# EAGLE design DAC (EAGLE 8.4.3)
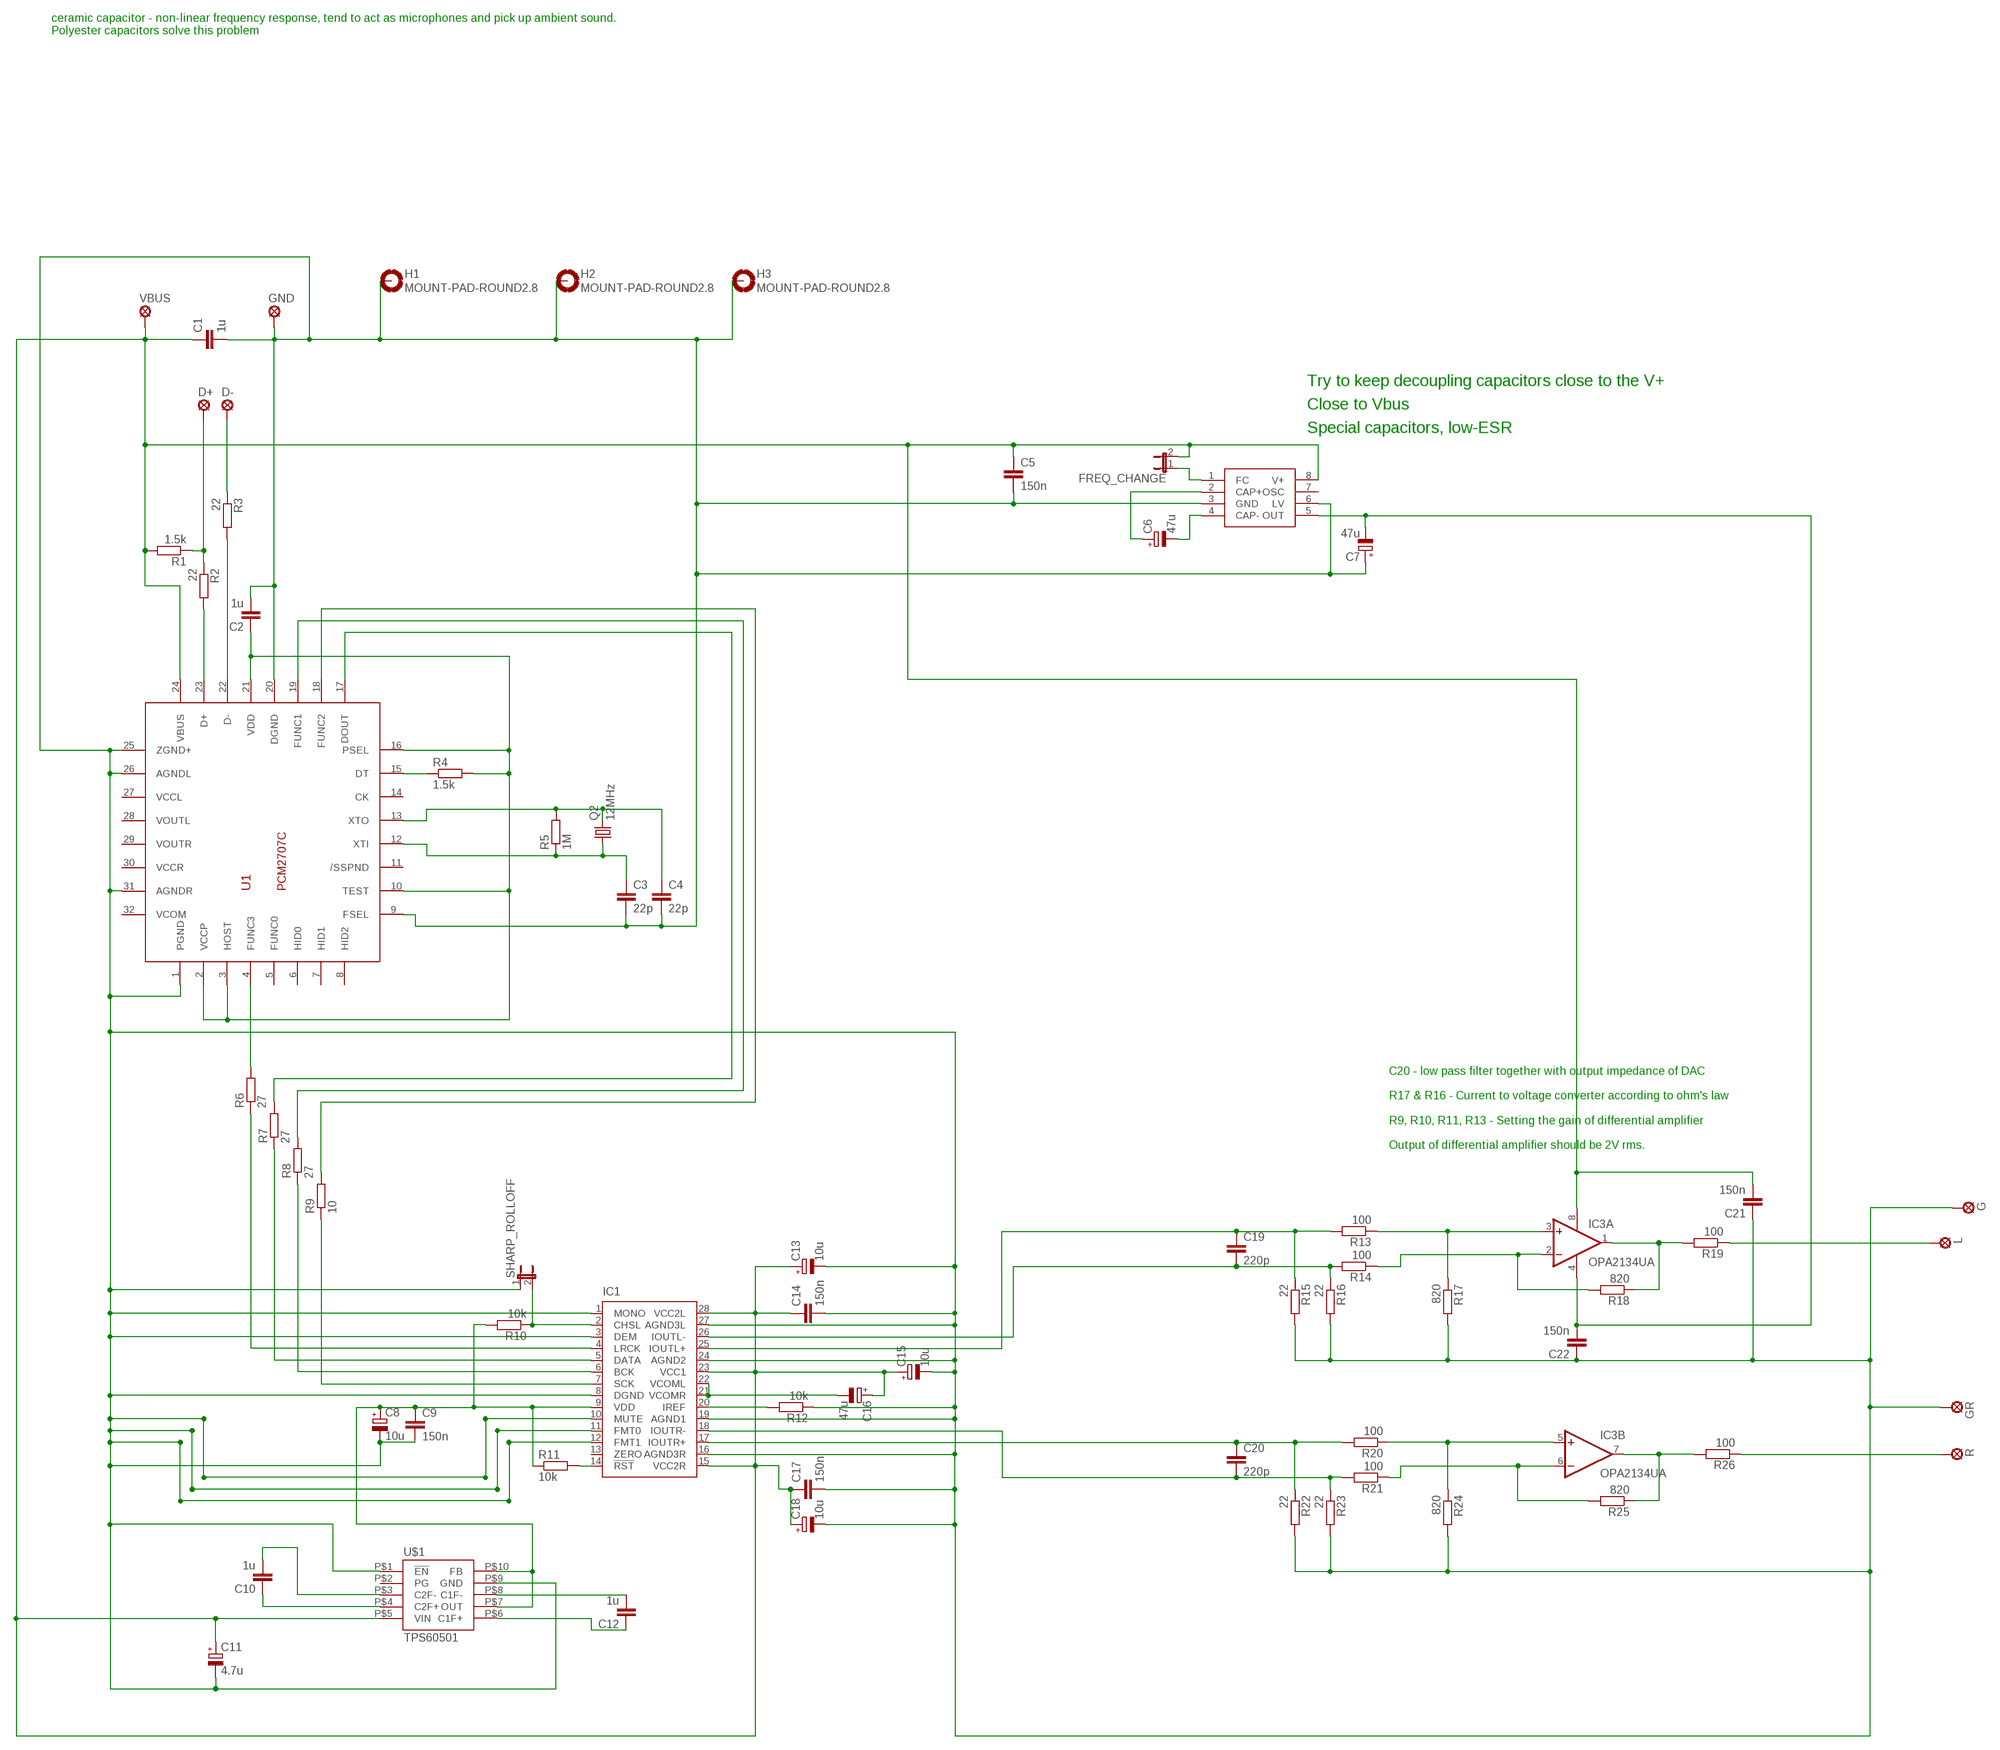
[diagram p0: schematic, sheet 1]

## Parts
C1  1u  C-EU050-050X075  [C050-050X075]
C2  1u  C-EU050-050X075  [C050-050X075]
C3  22p  C-EUC0603  [C0603]
C4  22p  C-EUC0603  [C0603]
C5  150n  C-EU050-025X075  [C050-025X075]
C6  47u  CPOL-EUD  [PANASONIC_D]
C7  47u  CPOL-EUD  [PANASONIC_D]
C8  10u  CPOL-EU153CLV-0405  [153CLV-0405]
C9  150n  C-EU050-025X075  [C050-025X075]
C10  1u  C-EU050-050X075  [C050-050X075]
C11  4.7u  CPOL-EUE2-5  [E2-5]
C12  1u  C-EU050-050X075  [C050-050X075]
C13  10u  CPOL-EUE2-5  [E2-5]
C14  150n  C-EU050-025X075  [C050-025X075]
C15  10u  CPOL-EUE2-5  [E2-5]
C16  47u  CPOL-EUE2-5  [E2-5]
C17  150n  C-EU050-025X075  [C050-025X075]
C18  10u  CPOL-EUE2-5  [E2-5]
C19  220p  C-EU025-024X044  [C025-024X044]
C20  220p  C-EU025-024X044  [C025-024X044]
C21  150n  C-EU050-025X075  [C050-025X075]
C22  150n  C-EU050-025X075  [C050-025X075]
D+  LSP10  [LSP10]
D-  LSP10  [LSP10]
FREQ_CHANGE  JP1E  [JP1]
G  LSP10  [LSP10]
GND  LSP10  [LSP10]
GR  LSP10  [LSP10]
H1  MOUNT-PAD-ROUND2.8  [2,8-PAD]
H2  MOUNT-PAD-ROUND2.8  [2,8-PAD]
H3  MOUNT-PAD-ROUND2.8  [2,8-PAD]
IC1  PCM1794A  [SSOP28DB]
IC3  OPA2134UA  [SO08]
L  LSP10  [LSP10]
Q2  12MHz  CRYSTALHC49S  [HC49/S]
R  LSP10  [LSP10]
R1  1.5k  R-EU_R0603  [R0603]
R2  22  R-EU_R0603  [R0603]
R3  22  R-EU_R0603  [R0603]
R4  1.5k  R-EU_R0603  [R0603]
R5  1M  R-EU_R0603  [R0603]
R6  27  R-EU_R0603  [R0603]
R7  27  R-EU_R0603  [R0603]
R8  27  R-EU_R0603  [R0603]
R9  10  R-EU_R0603  [R0603]
R10  10k  R-EU_R0603  [R0603]
R11  10k  R-EU_R0603  [R0603]
R12  10k  R-EU_0207/10  [0207/10]
R13  100  R-EU_0207/10  [0207/10]
R14  100  R-EU_0207/10  [0207/10]
R15  22  R-EU_0207/10  [0207/10]
R16  22  R-EU_0207/10  [0207/10]
R17  820  R-EU_0207/10  [0207/10]
R18  820  R-EU_0207/10  [0207/10]
R19  100  R-EU_0207/10  [0207/10]
R20  100  R-EU_0207/10  [0207/10]
R21  100  R-EU_0207/10  [0207/10]
R22  22  R-EU_0207/10  [0207/10]
R23  22  R-EU_0207/10  [0207/10]
R24  820  R-EU_0207/10  [0207/10]
R25  820  R-EU_0207/10  [0207/10]
R26  100  R-EU_0207/10  [0207/10]
SHARP_ROLLOFF  JP1E  [JP1]
U1  PCM2707C  PCM2707C_TQFP32"  [32TQFP_PCM2707C]
U$1  TPS60501  [VSSOP10]
U$2  LM2662  [SOIC8]
VBUS  LSP10  [LSP10]

## Nets
D+: D+.MP R1.1 R2.1
D-: D-.MP R3.1
GND: C1.2 C2.2 C3.2 C4.2 C5.2 C7.+ C8.- C9.2 C11.- C13.- C14.2 C15.- C17.2 C18.- C21.1 C22.1 G.MP GND.MP GR.MP H1.B2,8(MOUNT) H2.B2,8(MOUNT) H3.B2,8(MOUNT) IC1.1(MONO) IC1.3(DEM) IC1.8(DGND) IC1.10(MUTE) IC1.11(FMT0) IC1.12(FMT1) IC1.16(AGND3R) IC1.19(AGND1) IC1.24(AGND2) IC1.27(AGND3L) R12.1 R15.2 R16.2 R17.2 R22.2 R23.2 R24.2 SHARP_ROLLOFF.1 U1.1(PGND) U1.9(FSEL) U1.20(DGND) U1.25(ZGND+) U1.26(AGNDL) U1.31(AGNDR) U$1.P$1(!EN) U$1.P$9(GND) U$2.3(GND) U$2.6(LV)
N$1: R2.2 U1.23(D+)
N$2: R3.2 U1.22(D-)
N$3: C2.1 R4.2 U1.2(VCCP) U1.3(HOST) U1.10(TEST) U1.16(PSEL) U1.21(VDD)
N$4: R4.1 U1.15(DT)
N$5: C4.1 Q2.2 R5.2 U1.13(XTO)
N$6: C3.1 Q2.1 R5.1 U1.12(XTI)
N$7: C10.1 U$1.P$4(C2F+)
N$8: C10.2 U$1.P$3(C2F-)
N$9: IC1.20(IREF) R12.2
N$10: C12.2 U$1.P$8(C1F-)
N$11: C6.- U$2.4(CAP-)
N$12: IC1.5(DATA) R7.1
N$13: IC3.2(A:-IN) R14.1 R18.2
N$14: IC3.7(B:OUT) R25.1 R26.2
N$15: C12.1 U$1.P$6(C1F+)
N$17: IC1.14(!RST) R11.2
N$18: IC1.6(BCK) R8.1
N$19: IC1.2(CHSL) R10.1 SHARP_ROLLOFF.2
N$20: IC1.4(LRCK) R6.1
N$21: R7.2 U1.17(DOUT)
N$22: R8.2 U1.19(FUNC1)
N$23: R9.2 U1.18(FUNC2)
N$24: C19.2 IC1.26(IOUTL-) R14.2 R16.1
N$25: C19.1 IC1.25(IOUTL+) R13.2 R15.1
N$26: C20.1 IC1.17(IOUTR+) R20.2 R22.1
N$27: C20.2 IC1.18(IOUTR-) R21.2 R23.1
N$28: IC3.6(B:-IN) R21.1 R25.2
N$29: IC3.1(A:OUT) R18.1 R19.2
N$30: FREQ_CHANGE.1 U$2.1(FC)
N$31: C6.+ U$2.2(CAP+)
N$32: IC3.3(A:+IN) R13.1 R17.1
N$33: C16.- IC1.21(VCOMR) IC1.22(VCOML)
N$35: L.MP R19.1
N$36: IC3.5(B:+IN) R20.1 R24.1
N$37: C1.1 C5.1 C11.+ C13.+ C14.1 C15.+ C16.+ C17.1 C18.+ C21.2 FREQ_CHANGE.2 IC1.15(VCC2R) IC1.23(VCC1) IC1.28(VCC2L) IC3.8(A:V+) R1.2 U1.24(VBUS) U$1.P$5(VIN) U$2.8(V+) VBUS.MP
N$38: C8.+ C9.1 IC1.9(VDD) R10.2 R11.1 U$1.P$7(OUT) U$1.P$10(FB)
N$39: R26.1 R.MP
N$40: IC1.7(SCK) R9.1
N$43: R6.2 U1.4(FUNC3)
NEG_VOLTAGE: C7.- C22.2 IC3.4(A:V-) U$2.5(OUT)
Unconnected: IC1.13(ZERO) U1.5(FUNC0) U1.6(HID0) U1.7(HID1) U1.8(HID2) U1.11(/SSPND) U1.14(CK) U1.27(VCCL) U1.28(VOUTL) U1.29(VOUTR) U1.30(VCCR) U1.32(VCOM) U$1.P$2(PG) U$2.7(OSC)

## Notes on the sheet
- ceramic capacitor - non-linear frequency response, tend to act as microphones and pick up ambient sound.
  Polyester capacitors solve this problem
- Try to keep decoupling capacitors close to the V+
- Close to Vbus
- Special capacitors, low-ESR
- C20 - low pass filter together with output impedance of DAC
  
  R17 & R16 - Current to voltage converter according to ohm's law
  
  R9, R10, R11, R13 - Setting the gain of differential amplifier
  
  Output of differential amplifier should be 2V rms.

## Library data of the parts
C1-C5 C9 C10 C12 C14 C17 C19-C22 = resistor:C-EU: CAPACITOR, European symbol
C6-C8 C11 C13 C15 C16 C18 = resistor:CPOL-EU: POLARIZED CAPACITOR, European symbol
D+ D- G GND GR L R VBUS = solpad:LSP10: SOLDER PAD drill 1.0 mm, distributor Buerklin, 12H555
FREQ_CHANGE SHARP_ROLLOFF = jumper:JP1E: JUMPER
H1-H3 = holes:MOUNT-PAD-ROUND: MOUNTING PAD, round
IC1 = pavouk:PCM1794A: 24-BIT, 192-kHz SAMPLING, ADVANCED SEGMENT, AUDIO STEREO DIGITAL-TO-ANALOG CONVERTER
IC3 = linear:OPA2*: Dual Operational Amplifier Low Power, Single-Supply, Rail-To-Rail Operational Amplifier Source: http://focus.ti.com/lit/ds/symlink/opa2345.pdf http://focus.ti.com .. opa241.pdf http://focus.ti.com/lit/ds/symlink/opa2134.pdf
Q2 = crystal:CRYSTAL: CRYSTAL; OC_FARNELL: 1667008; OC_NEWARK: unknown
R1-R26 = resistor:R-EU_: RESISTOR, European symbol
U1 = lowderlib:PCM2707C_TQFP32: Stereo Audio DAC with USB Interface, Single-Ended Headphone Output, and S/PDIF Output
U$1 = TPS60501:TPS60501
U$2 = LM2662:LM2662

## Board
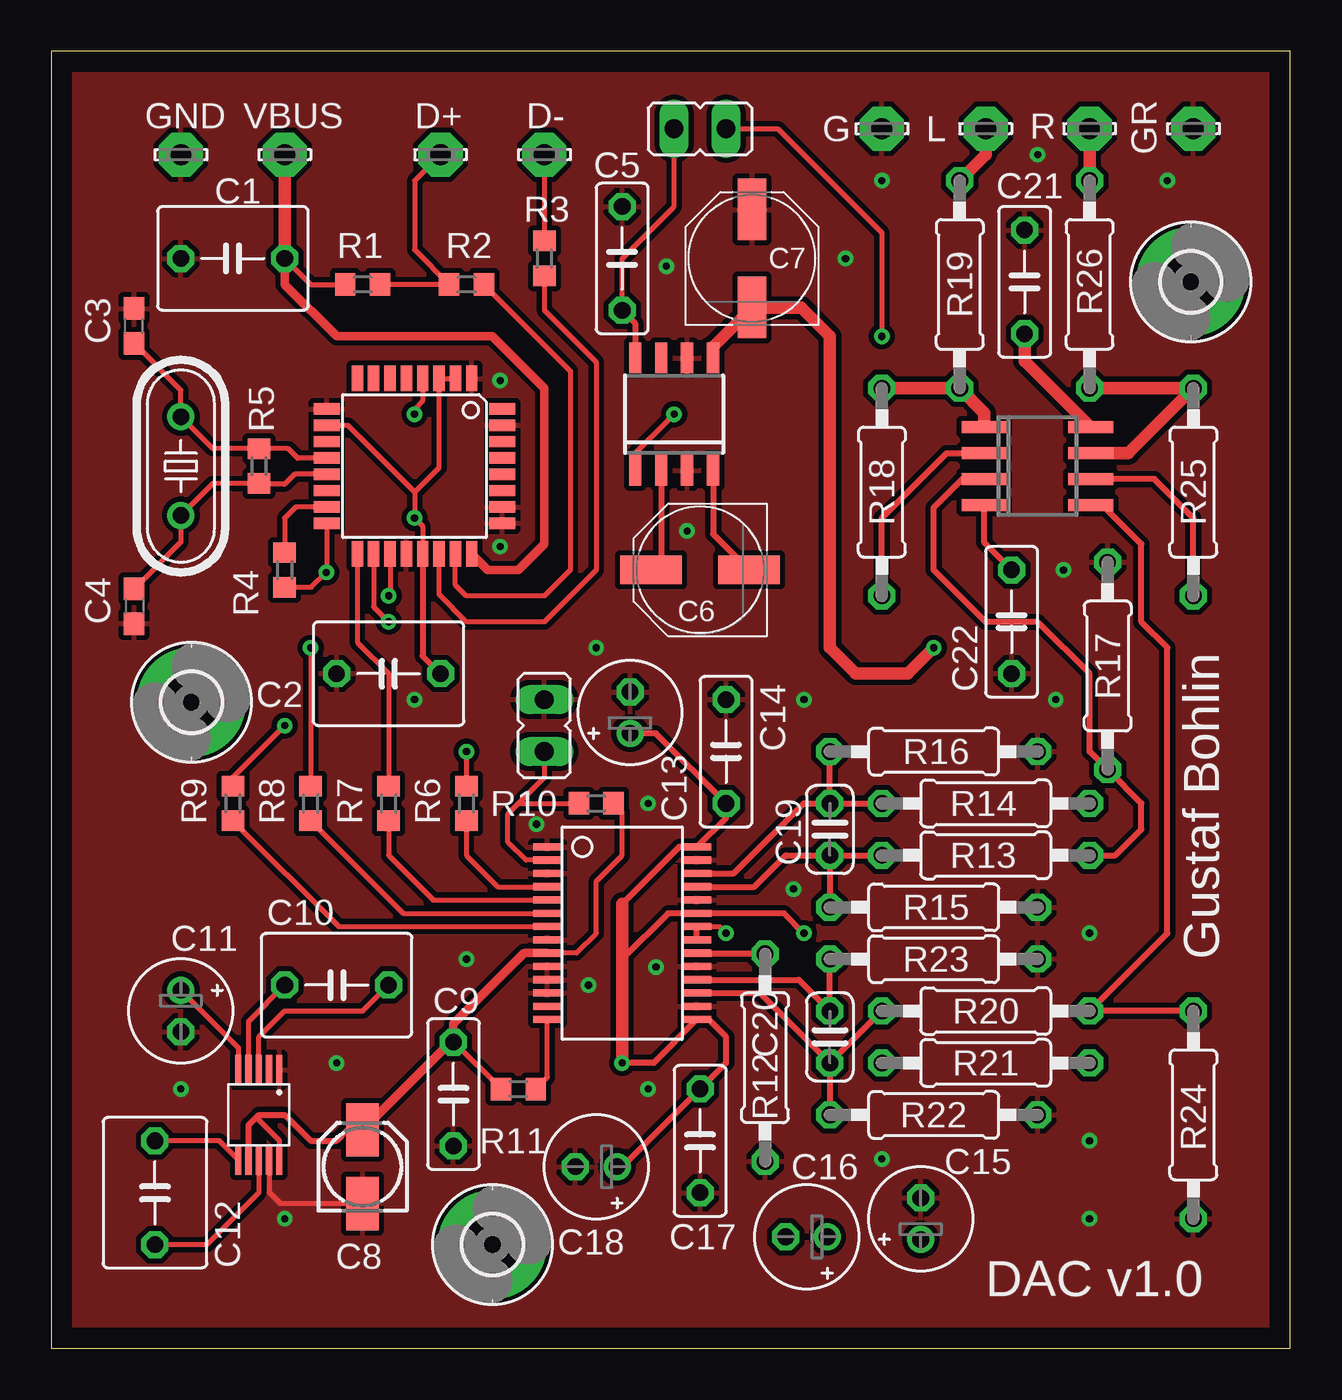
[diagram p1: board, top side]
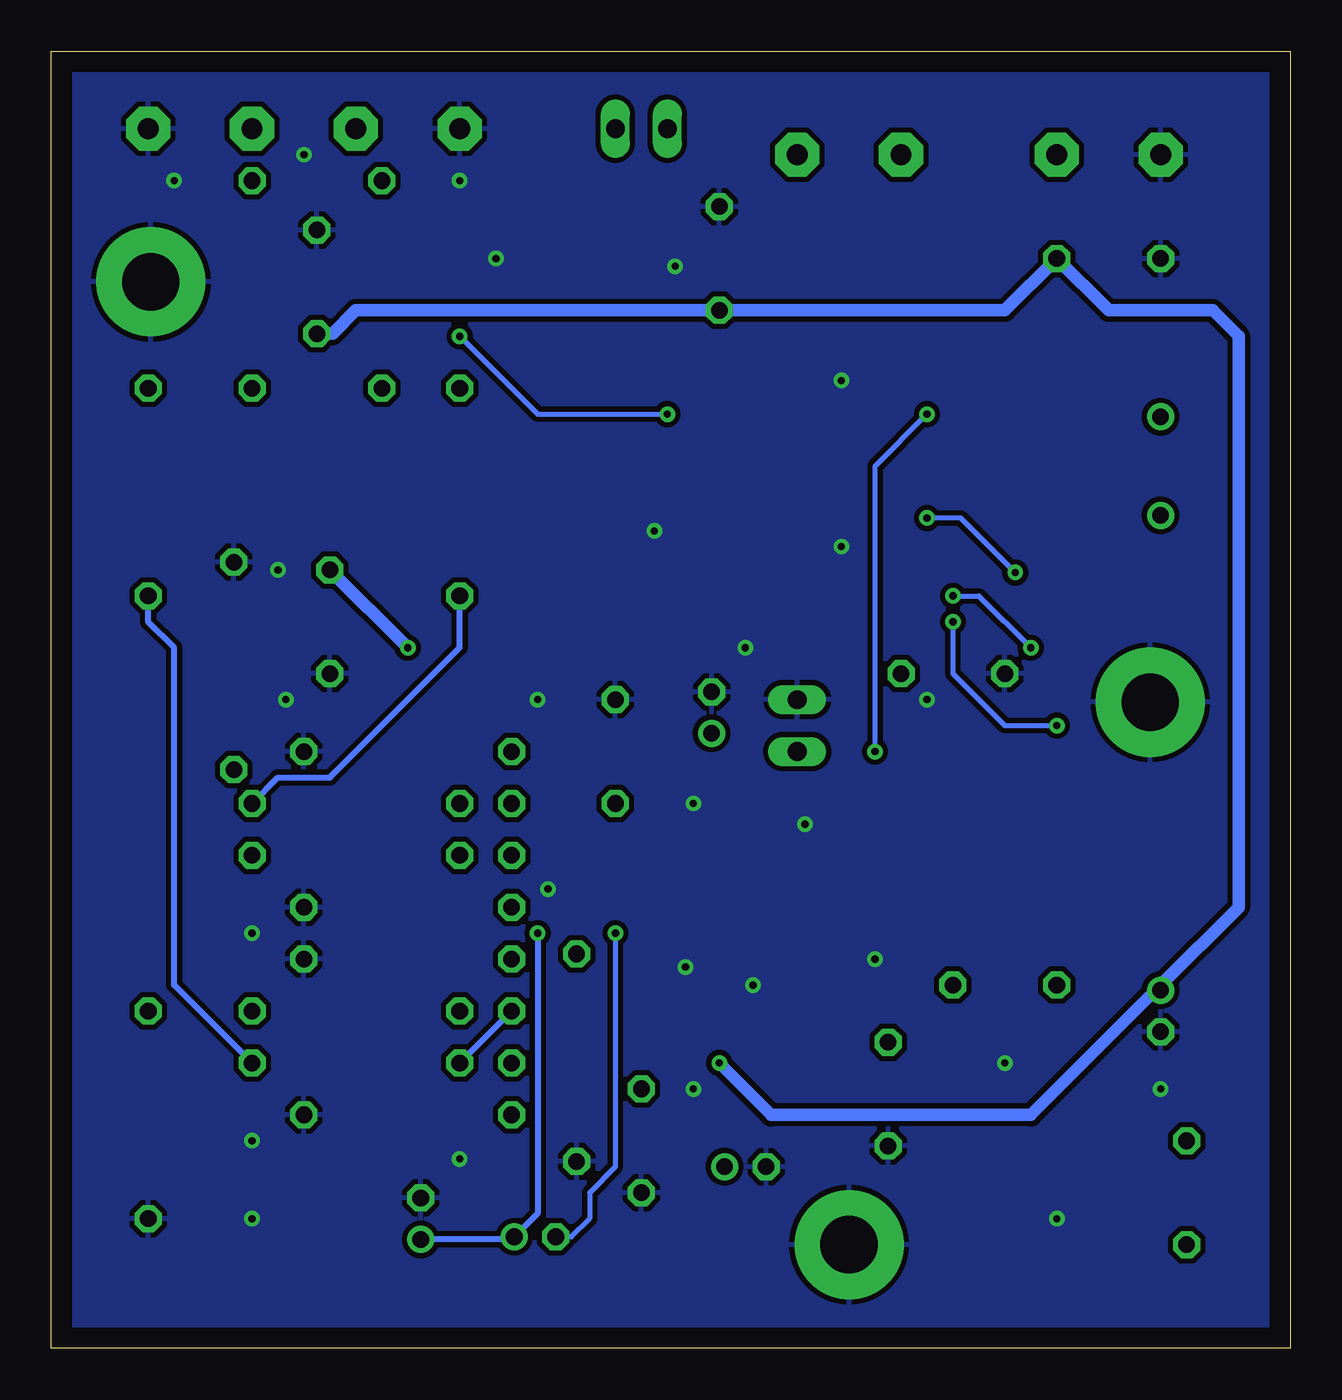
[diagram p2: board, bottom side, seen from below]

Size 60.63 x 63.49 mm. Coordinates in mm from the lower left corner, seen from the top.
Outline: 0,0 60.63,0 60.63,63.49 0,63.49 0,0
Copper layers (1*16): Top 0.035mm / dielectric 1.5mm / Bottom 0.035mm
Design rules "default *": minimum track width 10mil, minimum drill 0.35mm, track to track 7mil, track to pad 7mil, pad to pad 7mil, via to via 7mil, smd to smd 6mil, copper to edge 40mil, drill to drill 6mil, minimum pad ring 10mil, minimum via ring 8mil, stop-mask expansion 4mil, vias tented up to drill 0mil, thermal gap 10mil

### Footprints (pad centres in the part's own frame; a part is rotated, then mirrored left to right if it is on the bottom)
C050-050X075 = drill 0.813 octagon: 1 -2.54,0; 2 2.54,0
C0603 = smd 1.1 x 1: 1 -0.85,0; 2 0.85,0
C050-025X075 = drill 0.813 octagon: 1 -2.54,0; 2 2.54,0
PANASONIC_D = smd 3 x 1.4: + 2.4,0; - -2.4,0
153CLV-0405 = smd 2.6 x 1.6: + 1.8,0; - -1.8,0
E2-5 = drill 0.813 pad 1.27: + -1.016,0 | drill 0.813 pad 1.27 octagon: - 1.016,0
C025-024X044 = drill 0.813 octagon: 1 -1.27,0; 2 1.27,0
LSP10 = drill 1.016 pad 2.159 octagon: MP 0,0
JP1 = drill 0.914 long: 1 0,-1.27; 2 0,1.27
2,8-PAD = drill 2.8 pad 5.334: B2,8 0,0
SSOP28DB = smd 0.348 x 1.397: 1 -4.225,-3.656; 2 -3.575,-3.656; 3 -2.925,-3.656; 4 -2.275,-3.656; 5 -1.625,-3.656; 6 -0.975,-3.656; 7 -0.325,-3.656; 8 0.325,-3.656; 9 0.975,-3.656; 10 1.625,-3.656; 11 2.275,-3.656; 12 2.925,-3.656; 13 3.575,-3.656; 14 4.225,-3.656; 15 4.225,3.656; 16 3.575,3.656; 17 2.925,3.656; 18 2.275,3.656; 19 1.625,3.656; 20 0.975,3.656; 21 0.325,3.656; 22 -0.325,3.656; 23 -0.975,3.656; 24 -1.625,3.656; 25 -2.275,3.656; 26 -2.925,3.656; 27 -3.575,3.656; 28 -4.225,3.656
SO08 = smd 0.6 x 2.2: 1 -1.905,-2.6; 2 -0.635,-2.6; 3 0.635,-2.6; 4 1.905,-2.6; 5 1.905,2.6; 6 0.635,2.6; 7 -0.635,2.6; 8 -1.905,2.6
HC49/S = drill 0.813: 1 -2.413,0; 2 2.413,0
R0603 = smd 1 x 1.1: 1 -0.85,0; 2 0.85,0
0207/10 = drill 0.813 octagon: 1 -5.08,0; 2 5.08,0
32TQFP_PCM2707C = smd 1.27 x 0.559: 1 -4.293,2.8; 2 -4.293,2; 3 -4.293,1.2; 4 -4.293,0.4; 5 -4.293,-0.4; 6 -4.293,-1.2; 7 -4.293,-2; 8 -4.293,-2.8; 17 4.293,-2.8; 18 4.293,-2; 19 4.293,-1.2; 20 4.293,-0.4; 21 4.293,0.4; 22 4.293,1.2; 23 4.293,2; 24 4.293,2.8 | smd 0.559 x 1.27: 9 -2.8,-4.293; 10 -2,-4.293; 11 -1.2,-4.293; 12 -0.4,-4.293; 13 0.4,-4.293; 14 1.2,-4.293; 15 2,-4.293; 16 2.8,-4.293; 25 2.8,4.293; 26 2,4.293; 27 1.2,4.293; 28 0.4,4.293; 29 -0.4,4.293; 30 -1.2,4.293; 31 -2,4.293; 32 -2.8,4.293
VSSOP10 = smd 0.3 x 1.45: P$1 -1,-2.2; P$2 -0.5,-2.2; P$3 0,-2.2; P$4 0.5,-2.2; P$5 1,-2.2; P$6 1,2.2; P$7 0.5,2.2; P$8 0,2.2; P$9 -0.5,2.2; P$10 -1,2.2
SOIC8 = smd 0.6 x 1.5: 1 -1.905,-2.75; 2 -0.635,-2.75; 3 0.635,-2.75; 4 1.905,-2.75; 5 1.905,2.75; 6 0.635,2.75; 7 -0.635,2.75; 8 -1.905,2.75

### Placement (x,y rotation side)
C1  8.89,53.34 180 top
C2  16.51,33.02 180 top
C3  4.06,50.04 90 top
C4  4.06,36.32 270 top
C5  27.94,53.34 90 top
C6  31.75,38.1 180 top
C7  34.29,53.34 90 top
C8  15.24,8.89 90 top
C9  19.68,12.45 270 top
C10  13.97,17.78 0 top
C11  6.35,16.51 270 top
C12  5.08,7.62 270 top
C13  28.32,31.12 90 top
C14  33.02,29.21 90 top
C15  42.55,6.35 90 top
C16  36.96,5.46 180 top
C17  31.75,10.16 270 top
C18  26.67,8.89 180 top
C19  38.1,25.4 90 top
C20  38.1,15.24 90 top
C21  47.62,52.2 270 top
C22  46.99,35.56 90 top
D+  19.05,58.42 0 top
D-  24.13,58.42 0 top
FREQ_CHANGE  31.75,59.69 90 top
G  40.64,59.69 0 top
GND  6.35,58.42 0 top
GR  55.88,59.69 0 top
H1  21.59,5.08 0 top
H2  6.86,31.62 0 top
H3  55.75,52.2 0 top
IC1  27.94,20.32 270 top
IC3  48.26,43.18 270 top
L  45.72,59.69 0 top
Q2  6.35,43.18 270 top
R  50.8,59.69 0 top
R1  15.24,52.07 180 top
R2  20.32,52.07 0 top
R3  24.13,53.34 270 top
R4  11.43,38.1 270 top
R5  10.16,43.18 270 top
R6  20.32,26.67 90 top
R7  16.51,26.67 90 top
R8  12.7,26.67 90 top
R9  8.89,26.67 90 top
R10  26.67,26.67 0 top
R11  22.86,12.7 0 top
R12  34.92,14.22 90 top
R13  45.72,24.13 180 top
R14  45.72,26.67 180 top
R15  43.18,21.59 0 top
R16  43.18,29.21 0 top
R17  51.69,33.4 90 top
R18  40.64,41.91 270 top
R19  44.45,52.07 270 top
R20  45.72,16.51 180 top
R21  45.72,13.97 180 top
R22  43.18,11.43 0 top
R23  43.18,19.05 0 top
R24  55.88,11.43 270 top
R25  55.88,41.91 270 top
R26  50.8,52.07 270 top
SHARP_ROLLOFF  24.13,30.48 180 top
U1  17.78,43.18 270 top
U$1  10.16,11.43 180 top
U$2  30.48,45.72 0 top
VBUS  11.43,58.42 0 top

### Tracks (layer width: path | path; a pad name or v marks a point on that pad's centre or on a via)
D+
  Top 0.254: R1.1 R2.1 17.78,53.76 17.78,57.15 D+.MP
D-
  Top 0.254: D-.MP R3.1
GND  (via drill 0.35)
  Top 0.254: U$1.P$9 10.66,7.63 11.2,7.09 C8.-
  other vias: 36.32,22.48 29.59,18.67 29.21,26.67 23.75,25.65 20.32,19.05 26.29,17.78 29.21,12.7 40.64,9.27 50.8,10.16 50.8,6.35 50.8,20.32 49.15,31.75 49.53,38.1 48.26,58.42 31.11,40 30.1,52.96 38.86,53.34 21.97,39.24 21.97,47.37 17.78,31.75 26.67,34.29 36.83,31.75 6.35,12.7 11.43,6.35 13.97,13.97 54.61,57.15 40.64,57.15
  pour Top (isolate 0.254): 0,63.5 0,0 60.96,0 60.96,63.5
  pour Bottom (isolate 0.254): 0,63.5 0,0 60.96,0 60.96,63.5
N$1
  Top 0.254: R2.2 25.4,47.84 25.4,38.1 24.13,36.83 20.32,36.83 19.78,37.37 U1.23
N$2
  Top 0.254: R3.2 24.13,50.8 26.67,48.26 26.67,38.1 24.13,35.56 20.32,35.56 18.98,36.9 U1.22
N$3  (via drill 0.35)
  Top 0.254: R4.2 12.74,37.25 v13.46,37.97 13.49,38 U1.16 | U1.21 18.18,40.24 v17.78,40.64 17.78,41.91 | U1.10 14.51,45.18 17.78,41.91 | 17.78,41.91 18.98,43.11 U1.3 U1.2
  Top 0.305: C2.1 18.18,33.89 U1.21
  Bottom 0.254: v13.46,37.97 16.13,40.64 v17.78,40.64
N$4
  Top 0.254: U1.15 11.97,41.18 11.43,40.64 R4.1
N$5
  Top 0.254: U1.13 11.92,42.78 11.43,42.29 10.2,42.29 R5.2 7.91,42.33 Q2.2 6.35,39.46 C4.1
N$6
  Top 0.254: U1.12 13.47,43.56 12.06,43.56 11.6,44.03 R5.1 7.91,44.03 Q2.1 6.35,46.9 C3.1
N$7
  Top 0.254: U$1.P$4 9.66,16.01 C10.1
N$8
  Top 0.254: U$1.P$3 10.16,15.24 11.43,16.51 15.24,16.51 C10.2
N$9
  Top 0.305: R12.2 31.64,19.3 IC1.20
N$10
  Top 0.254: U$1.P$8 10.16,7.62 7.62,5.08 C12.2
N$11
  Top 0.305: U$2.4 32.38,39.87 C6.-
N$12
  Top 0.254: R7.1 16.51,24.13 18.7,21.95 IC1.5
N$13
  Top 0.305: R18.2 40.64,40.64 43.81,43.81 IC3.2
  Bottom 0.305: R14.1 49.53,27.94 46.99,27.94 40.64,34.29 R18.2
N$14
  Top 0.61: R26.2 R25.1 52.7,43.81 IC3.7
N$15
  Top 0.254: U$1.P$6 8.23,10.16 C12.1
N$17
  Top 0.254: R11.2 24.28,13.27 IC1.14
N$18
  Top 0.254: R8.1 17.23,21.3 IC1.6
N$19
  Top 0.254: IC1.2 23.22,23.89 22.35,24.77 22.35,26.16 22.86,26.67 | 22.86,26.67 R10.1 | SHARP_ROLLOFF.2 24.13,27.94 22.86,26.67
N$20
  Top 0.254: R6.1 20.32,24.13 21.86,22.59 IC1.4
N$21
  Top 0.254: U1.17 14.98,34.55 16.51,33.02 R7.2
N$22  (via drill 0.35)
  Top 0.254: U1.19 16.58,36.9 v16.51,36.83 | v12.7,34.29 R8.2
  Bottom 0.254: v16.51,36.83 15.24,36.83 v12.7,34.29
N$23  (via drill 0.35)
  Top 0.254: U1.18 15.78,36.29 v16.51,35.56 | v11.43,30.48 8.89,27.94 R9.2
  Bottom 0.254: v16.51,35.56 16.51,33.02 13.97,30.48 v11.43,30.48
N$24
  Top 0.305: IC1.26 33.41,23.24 36.83,26.67 C19.2 | C19.2 R14.2 | C19.2 R16.1
N$25
  Top 0.305: IC1.25 34.41,22.59 35.94,24.13 C19.1 | C19.1 R15.1 | C19.1 R13.2
N$26
  Top 0.305: IC1.17 34.67,17.39 C20.1 | C20.1 R22.1 | C20.1 R20.2
N$27
  Top 0.305: IC1.18 36.56,18.05 C20.2 R23.1
  Bottom 0.305: C20.2 R21.2
N$28
  Top 0.305: R25.2 55.88,40.64 53.98,42.55 IC3.6
  Bottom 0.305: R21.1 54.61,17.78 54.61,34.29 55.88,35.56 R25.2
N$29
  Top 0.61: R18.1 R19.2 45.66,45.78 IC3.1
N$30  (via drill 0.35)
  Top 0.254: FREQ_CHANGE.1 35.56,59.69 40.64,54.61 v40.64,49.53 | v30.48,45.72 28.57,43.81 U$2.1
  Bottom 0.254: v40.64,49.53 36.83,45.72 v30.48,45.72
N$31
  Top 0.305: U$2.2 29.84,38.59 C6.+
N$32
  Top 0.305: R13.1 52.07,24.13 53.34,25.4 53.34,26.67 R17.1 50.8,29.21 50.8,33.02 48.26,35.56 45.72,35.56 43.18,38.1 43.18,41.15 44.58,42.55 IC3.3
N$33  (via drill 0.35)
  Top 0.254: IC1.22 32.7,20.64 v33.02,20.32
  Top 0.305: IC1.21 IC1.22
  Bottom 0.254: v33.02,20.32 33.02,8.89 34.29,7.62 34.29,6.35 35.18,5.46 C16.-
N$35
  Top 0.61: R19.1 45.72,58.42 L.MP
N$36
  Top 0.305: R24.1 R20.1 54.61,20.32 54.61,34.29 53.34,35.56 53.34,39.37 51.44,41.27 IC3.5
N$37  (via drill 0.35)
  Top 0.254: C1.1 12.7,52.07 R1.2 | C5.1 27.94,53.34 30.48,55.88 FREQ_CHANGE.2 | C11.+ 9.16,14.72 U$1.P$5
  Top 0.305: C13.+ 29.59,30.1 C14.1 33.02,25.97 IC1.28 30.73,24.55 27.94,21.76 | C18.+ 27.94,8.89 C17.1 33.02,13.97 33.02,15.24 32.16,16.09 IC1.15 29.47,13.97 v27.94,13.97 | v36.83,20.32 35.85,21.3 IC1.23 30.18,21.3 27.94,19.05 | C5.1 28.57,50.16 U$2.8
  Top 0.406: C1.1 11.43,52.07 13.97,49.53 21.59,49.53 24.13,46.99 24.13,39.37 22.86,38.1 21.37,38.1 U1.24
  Top 0.61: VBUS.MP C1.1 | 27.94,21.76 27.94,19.05 v27.94,13.97 | C21.2 47.62,48.32 IC3.8
  Bottom 0.305: v36.83,20.32 36.83,6.6 C16.+ 38.1,5.33 C15.+
  Bottom 0.61: v27.94,13.97 25.4,11.43 12.7,11.43 6.6,17.53 C11.+ 6.35,17.78 2.54,21.59 2.54,49.53 3.81,50.8 8.89,50.8 C1.1 13.97,50.8 C5.1 45.72,50.8 46.86,49.66 C21.2
N$38
  Top 0.254: IC1.9 25.7,19.34 26.67,20.32 26.67,22.86 27.94,24.13 27.94,26.25 R10.2 | U$1.P$10 11.18,9.25 11.18,10.16 10.16,11.18 10.16,11.43 | R11.1 19.72,14.99 C9.1
  Top 0.305: 15.77,10.69 C8.+ 14.5,10.69 13.97,10.16 12.7,10.16 11.43,11.43 10.16,11.43 9.66,10.93 U$1.P$7
  Top 0.406: IC1.9 23.16,19.34 19.68,15.88 C9.1 19.54,14.99 C8.+
N$39
  Top 0.61: R26.1 R.MP
N$40
  Top 0.254: R9.1 14.06,20.64 IC1.7
N$43  (via drill 0.35)
  Top 0.254: v20.32,29.21 R6.2 | v17.78,45.72 17.78,45.97 18.18,46.37 U1.4
  Bottom 0.254: v20.32,29.21 20.32,43.18 v17.78,45.72
NEG_VOLTAGE  (via drill 0.35)
  Top 0.305: C22.2 45.66,39.43 IC3.4
  Top 0.61: U$2.5 32.38,49.03 C7.- 36.69,50.94 38.1,49.53 38.1,34.29 39.37,33.02 41.91,33.02 v43.18,34.29
  Bottom 0.61: v43.18,34.29 C22.2

### Text on the board
tNames: Gustaf Bohlin | DAC v1.0